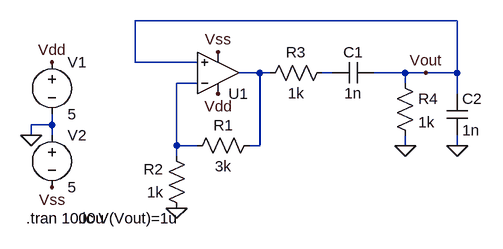
[diagram p0: schematic Wien Bridge Oscillator.asc]
Wien Bridge Oscillator.asc, the LTspice schematic file:
Version 4
SHEET 1 880 680
WIRE 560 48 64 48
WIRE 64 112 64 48
WIRE 160 112 64 112
WIRE 256 128 224 128
WIRE 272 128 256 128
WIRE 368 128 352 128
WIRE 480 128 432 128
WIRE 512 128 480 128
WIRE 560 128 560 48
WIRE 560 128 512 128
WIRE 160 144 128 144
WIRE 480 144 480 128
WIRE 560 160 560 128
WIRE -64 208 -64 192
WIRE -64 208 -96 208
WIRE -96 224 -96 208
WIRE -64 224 -64 208
WIRE 128 240 128 144
WIRE 160 240 128 240
WIRE 256 240 256 128
WIRE 256 240 240 240
WIRE 480 240 480 224
WIRE 560 240 560 224
WIRE 128 256 128 240
FLAG -64 112 Vdd
FLAG 192 160 Vdd
FLAG -64 304 Vss
FLAG 192 96 Vss
FLAG -96 224 0
FLAG 128 336 0
FLAG 512 128 Vout
FLAG 480 240 0
FLAG 560 240 0
SYMBOL Opamps\\UniversalOpamp2 192 128 M180
SYMATTR InstName U1
SYMBOL voltage -64 96 R0
WINDOW 123 0 0 Left 2
WINDOW 39 0 0 Left 2
SYMATTR InstName V1
SYMATTR Value 5
SYMBOL voltage -64 208 R0
WINDOW 123 0 0 Left 2
WINDOW 39 0 0 Left 2
SYMATTR InstName V2
SYMATTR Value 5
SYMBOL res 256 224 R90
WINDOW 0 0 56 VBottom 2
WINDOW 3 32 56 VTop 2
SYMATTR InstName R1
SYMATTR Value 3k
SYMBOL res 144 352 R180
WINDOW 0 36 76 Left 2
WINDOW 3 36 40 Left 2
SYMATTR InstName R2
SYMATTR Value 1k
SYMBOL res 368 112 R90
WINDOW 0 0 56 VBottom 2
WINDOW 3 32 56 VTop 2
SYMATTR InstName R3
SYMATTR Value 1k
SYMBOL cap 432 112 R90
WINDOW 0 0 32 VBottom 2
WINDOW 3 32 32 VTop 2
SYMATTR InstName C1
SYMATTR Value 1n
SYMBOL res 464 128 R0
SYMATTR InstName R4
SYMATTR Value 1k
SYMBOL cap 544 160 R0
SYMATTR InstName C2
SYMATTR Value 1n
TEXT -104 352 Left 2 !.tran 1000u
TEXT -24 352 Left 2 !.ic V(Vout)=1u

The netlist it stands for:
* Wien Bridge Oscillator.asc
XU1 Vout N003 Vdd Vss N001 level.2 Avol=1Meg GBW=10Meg Slew=10Meg ilimit=25m rail=0 Vos=0 phimargin=45 en=0 enk=0 in=0 ink=0 Rin=500Meg  ; pins IN+ IN- V+ V- OUT
V1 Vdd 0 5
V2 0 Vss 5
R1 N001 N003 3k
R2 0 N003 1k
R3 N002 N001 1k
C1 Vout N002 1n
R4 Vout 0 1k
C2 Vout 0 1n
.tran 1000u
.ic V(Vout)=1u
.lib UniversalOpamps2.sub
.backanno
.end